# Altium schematic sheet yyb_v2_modify.SchDoc
size A4
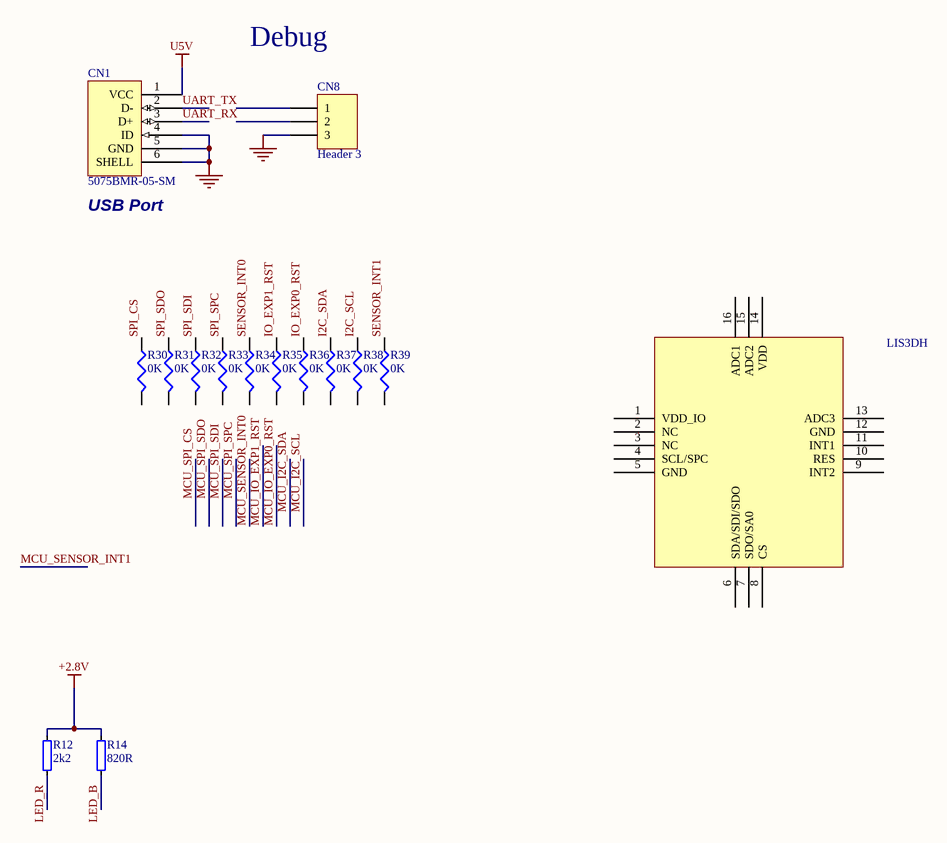
[diagram p0: yyb_v2_modify.SchDoc]

## Parts
?  LIS3DH
CN1  5075BMR-05-SM  [USB-MINI-B-SMD]
CN8  Header 3  [HDR1X3]
R12  2k2  [RESC1005X04L]
R14  820R  [RESC1005X04L]
R30  value 0K  [J1-0603]  (hidden comment: 0R)
R31  value 0K  [J1-0603]  (hidden comment: 0R)
R32  value 0K  [J1-0603]  (hidden comment: 0R)
R33  value 0K  [J1-0603]  (hidden comment: 0R)
R34  value 0K  [J1-0603]  (hidden comment: 0R)
R35  value 0K  [J1-0603]  (hidden comment: 0R)
R36  value 0K  [J1-0603]  (hidden comment: 0R)
R37  value 0K  [J1-0603]  (hidden comment: 0R)
R38  value 0K  [J1-0603]  (hidden comment: 0R)
R39  value 0K  [J1-0603]  (hidden comment: 0R)

## Nets
+2.8V: R12.2 R14.2
GND: CN1.4(ID) CN1.5(GND) CN1.6(SHELL) CN8.3
U5V: CN1.1(VCC)
I2C_SCL: R38.1
I2C_SDA: R37.1
IO_EXP0_RST: R36.1
IO_EXP1_RST: R35.1
SENSOR_INT0: R34.1
SENSOR_INT1: R39.1
SPI_CS: R30.1
SPI_SDI: R32.1
SPI_SDO: R31.1
SPI_SPC: R33.1
UART_RX: CN1.3(D+)
UART_TX: CN1.2(D-)

Not connected (* = marked no-connect by the designer): ? 1(VDD_IO) 2(NC) 3(NC) 4(SCL/SPC) 5(GND) 6(SDA/SDI/SDO) 7(SDO/SA0) 8(CS) 9(INT2) 10(RES) 11(INT1) 12(GND) 13(ADC3) 14(VDD) 15(ADC2) 16(ADC1); CN8 1 2; R12 1; R14 1; R30 2; R31 2; R32 2; R33 2; R34 2; R35 2; R36 2; R37 2; R38 2; R39 2

## Notes on the sheet
- Debug
- (near CN1) USB Port
- Labels drawn without touching a wire or pin: LED_B, LED_R

## Library data of the parts
CN1 = USB-MINI-typeB connector: Manuf_Part_1: 5075BMR-05-SM; Order: 5075BMR-05-SM; ECCN: ????
CN8 = Header 3: Header, 3-Pin; LatestRevisionDate: 17-Jul-2002; LatestRevisionNote: Re-released for DXP Platform.; Publisher: Altium Limited
R12 = R0402-2k2: Resistor, ?%, 0.063W; Note: Chip Res 1%; Artikkelnr Noca: 27049081; Part Number: R0402-2k2; Manufacturer: *; Manufacturer Part Number: *; Datasheet: *; Footprint: 0402; LatestRevisionDate: 2009-11-23; Pin Count: 2; Publisher: Nordic Semiconductor; Published: 2009-05-08; Value: 2k2; Supplier: Farnell; Supplier part number: 173-8854; 2nd source Supplier: *; 2nd source part number: *
R14 = R0402-820: Resistor, ?%, 0.063W; Note: Chip Res 1%; Artikkelnr Noca: 27049071; Part Number: R0402-820; Manufacturer: *; Manufacturer Part Number: *; Datasheet: *; Footprint: 0402; LatestRevisionDate: 2009-11-23; Pin Count: 2; Publisher: Nordic Semiconductor; Published: 2009-05-08; Value: 820R; Supplier: Farnell; Supplier part number: 173-8849; 2nd source Supplier: *; 2nd source part number: *
R30-R39 = Res3: Resistor; Published: 8-Jun-2000; LatestRevisionDate: 29-May-2009; LatestRevisionNote: IPC-7351 Footprint Added.; PackageReference: J1-0603; Publisher: Altium Limited; PackageDescription: Chip Resistor